# Altium schematic sheet DClink.SchDoc
size A4
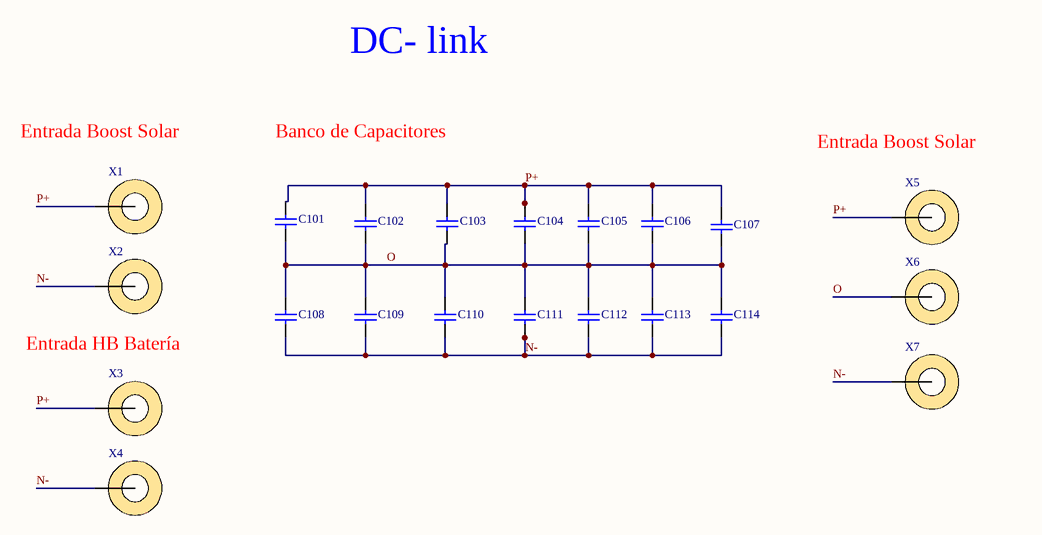
[diagram p0: DClink.SchDoc]

## Parts
C101  100nF  [CAP_EL450_ALC70C152EN450]  (value not drawn)
C102  100nF  [CAP_EL450_ALC70C152EN450]  (value not drawn)
C103  100nF  [CAP_EL450_ALC70C152EN450]  (value not drawn)
C104  100nF  [CAP_EL450_ALC70C152EN450]  (value not drawn)
C105  100nF  [CAP_EL450_ALC70C152EN450]  (value not drawn)
C106  100nF  [CAP_EL450_ALC70C152EN450]  (value not drawn)
C107  100nF  [CAP_EL450_ALC70C152EN450]  (value not drawn)
C108  100nF  [CAP_EL450_ALC70C152EN450]  (value not drawn)
C109  100nF  [CAP_EL450_ALC70C152EN450]  (value not drawn)
C110  100nF  [CAP_EL450_ALC70C152EN450]  (value not drawn)
C111  100nF  [CAP_EL450_ALC70C152EN450]  (value not drawn)
C112  100nF  [CAP_EL450_ALC70C152EN450]  (value not drawn)
C113  100nF  [CAP_EL450_ALC70C152EN450]  (value not drawn)
C114  100nF  [CAP_EL450_ALC70C152EN450]  (value not drawn)
X1  M6 Pad  [M6 PAD Connector]  (value not drawn)  (no BOM)
X2  M6 Pad  [M6 PAD Connector]  (value not drawn)  (no BOM)
X3  M6 Pad  [M6 PAD Connector]  (value not drawn)  (no BOM)
X4  M6 Pad  [M6 PAD Connector]  (value not drawn)  (no BOM)
X5  M6 Pad  [M6 PAD Connector]  (value not drawn)  (no BOM)
X6  M6 Pad  [M6 PAD Connector]  (value not drawn)  (no BOM)
X7  M6 Pad  [M6 PAD Connector]  (value not drawn)  (no BOM)

## Nets
N-: C108.2 C109.2 C110.2 C111.2 C112.2 C113.2 C114.2 X2.1 X4.1 X7.1
O: C101.2 C102.2 C103.2 C104.2 C105.2 C106.2 C107.2 C108.1 C109.1 C110.1 C111.1 C112.1 C113.1 C114.1 X6.1
P+: C101.1 C102.1 C103.1 C104.1 C105.1 C106.1 C107.1 X1.1 X3.1 X5.1

## Notes on the sheet
- DC- link
- Entrada Boost Solar
- Banco de Capacitores
- Entrada HB Batería

## Library data of the parts
C101-C114 = Cap_HV_El_ ALC70C152EN450: 0.1µF ±10% 50V Ceramic Capacitor X7R 1206 (3216 Metric); MF: KEMET; MFP: C1206C104K5RAC7025; Created: 2020_06_15_DAarancibia; Package: 1206; Value: 100nF; Supplier 1: Digi-Key; Supplier Part Number 1: 399-7356-1-ND
X1-X7 = Con_Pad_M6: Pad M6; Created: 2021_07_09_DArancibia; Value: M6 Pad